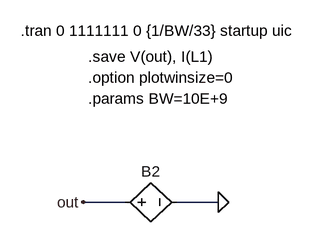
[diagram p0: schematic WhiteTest.asc]
WhiteTest.asc, the LTspice schematic file:
Version 4
SHEET 1 2316 7704
WIRE -5280 352 -5344 352
WIRE -5136 352 -5200 352
FLAG -5136 352 0
FLAG -5344 352 out
SYMBOL bv -5296 352 M90
WINDOW 3 32 56 Invisible 0
WINDOW 0 -32 56 VBottom 0
SYMATTR Value V=white(time*BW)
SYMATTR InstName B2
TEXT -5336 192 Left 0 !.params BW=10E+9
TEXT -5440 88 Left 0 !.tran 0 1111111 0 {1/BW/33} startup uic
TEXT -5336 128 Left 0 !.save V(out), I(L1)
TEXT -5336 160 Left 0 !.option plotwinsize=0

The netlist it stands for:
* WhiteTest.asc
B2 out 0 V=white(time*BW)
.params BW=10E+9
.tran 0 1111111 0 {1/BW/33} startup uic
.save V(out), I(L1)
.option plotwinsize=0
.backanno
.end